# EAGLE schematic divider_R_4R_1ohm (EAGLE 7.5.0)
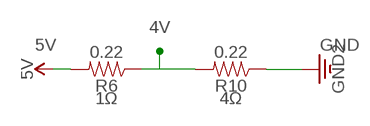
[diagram p0: schematic, sheet 1]

## Parts
R6  0.22  0.22OHM-0805-1/4W-1%  [0805]
R10  0.22  0.22OHM-0805-1/4W-1%  [0805]

## Nets
3.3V: R10.1 ; supply symbol labelled GND2
5V: R6.2
N$9: R6.1 R10.2

## Notes on the sheet
- 4V
- 5V | GND
- 1Ω | 4Ω

## Library data of the parts
R6 R10 = SparkFun-Resistors:0.22OHM: 0.22Ω resistor A resistor is a passive two-terminal electrical component that implements electrical resistance as a circuit element. Resistors act to reduce current flow, and, at the same time, act to lower voltage levels within circuits. - Wikipedia; PROD_ID: RES-09883